# EAGLE design T07 411 (EAGLE 7.1.0)
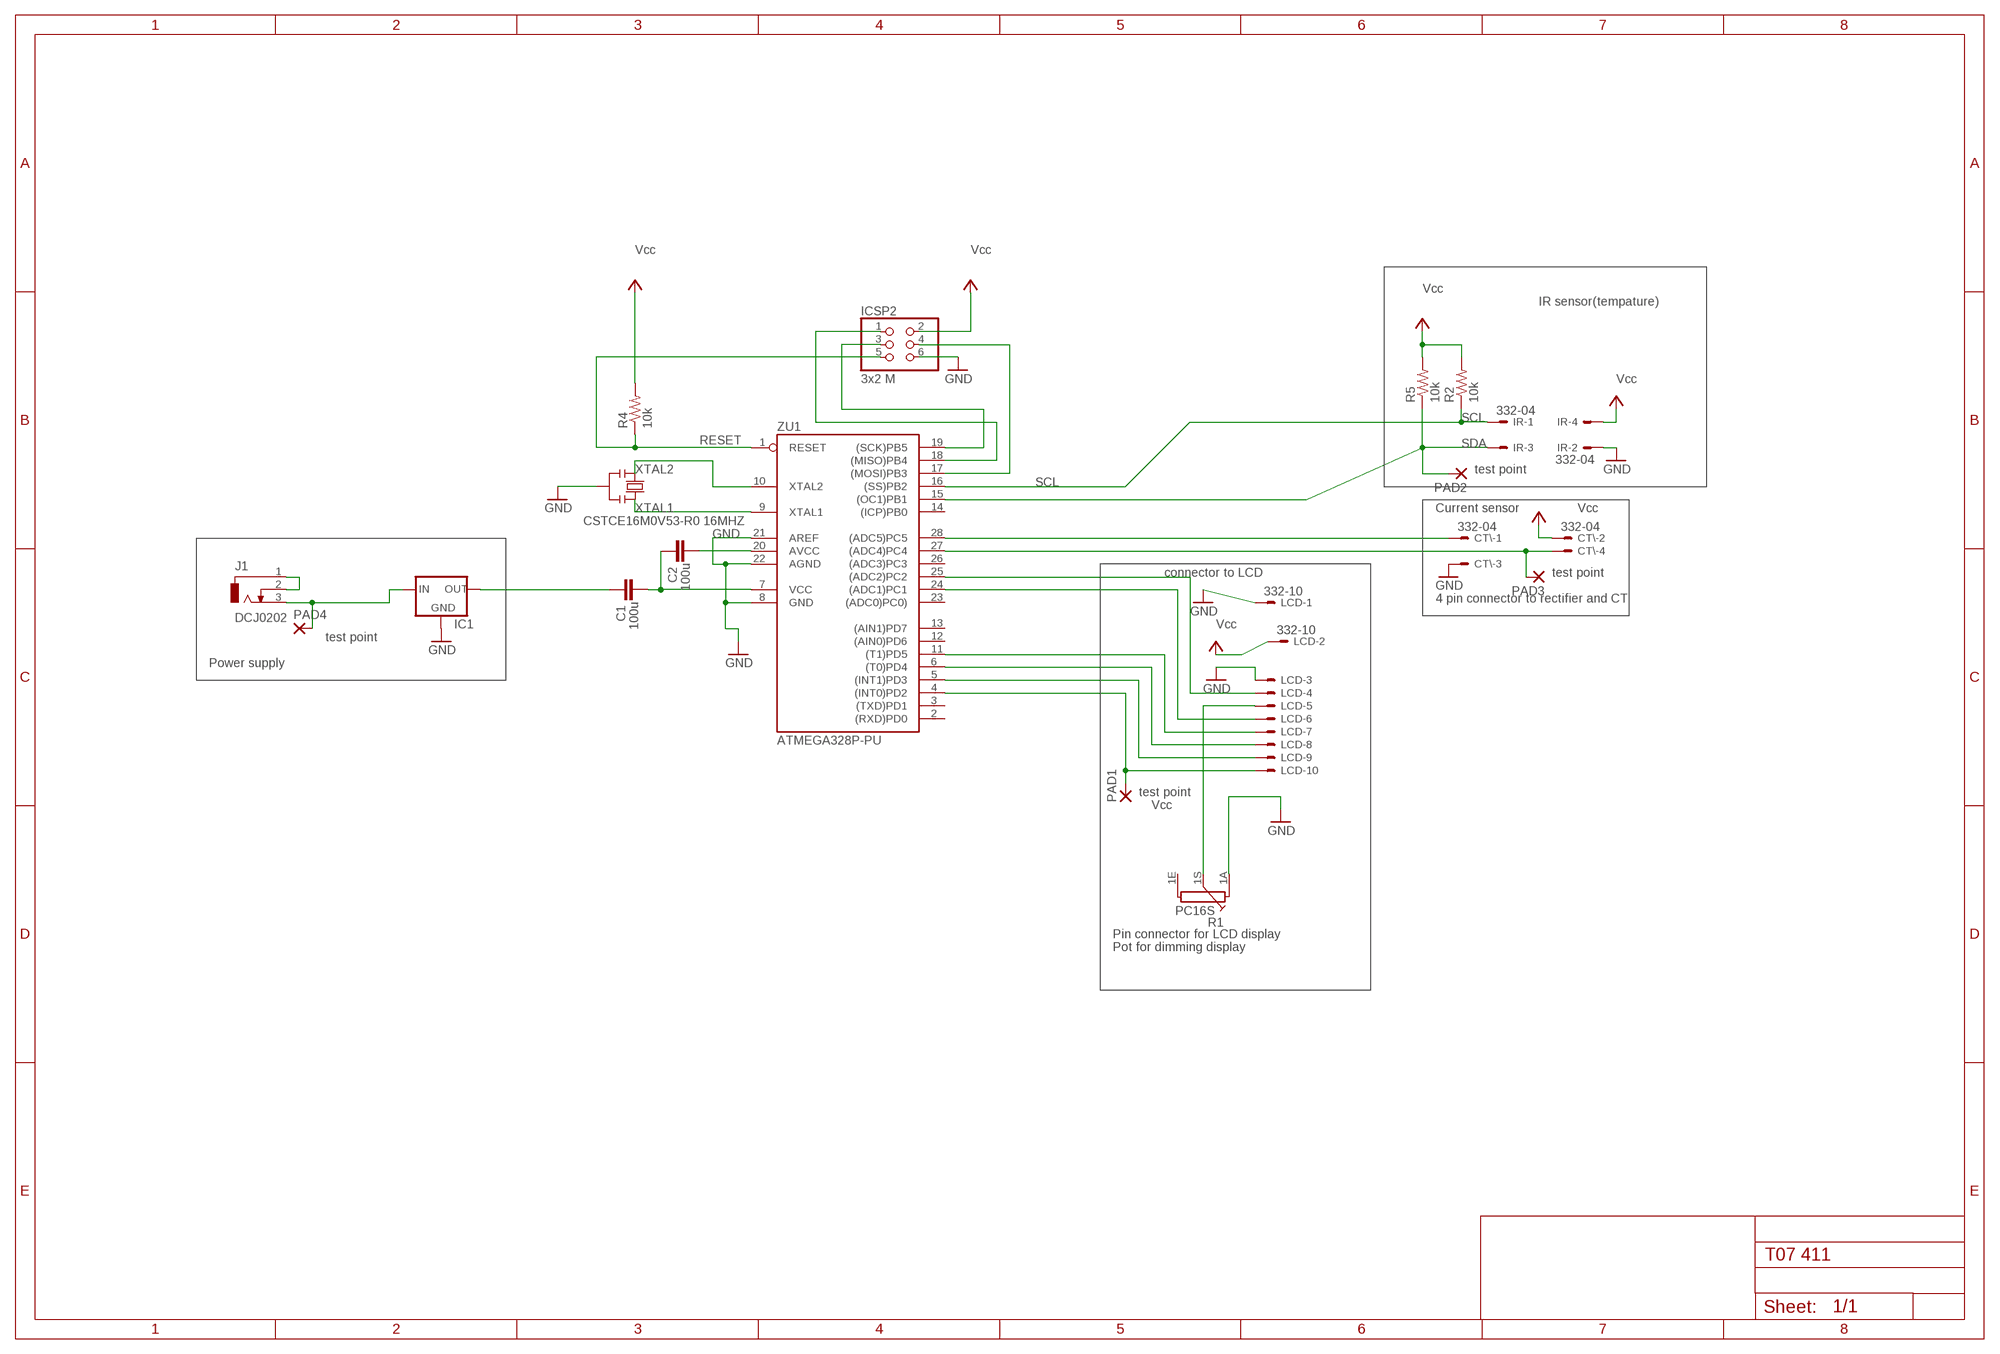
[diagram p0: schematic, sheet 1]

## Parts
C1  100u  C-EU0603-RND  [C0603-ROUND]
C2  100u  C-EU0603-RND  [C0603-ROUND]
CT\  332-04  [332-04]
IC1  78XXL  [78XXL]
ICSP2  3x2 M  PINHD-2X3  [2X03]
IR  332-04  [332-04]
J1  DCJ0202  [DCJ0202]
LCD  332-10  [332-10]
PAD1  1,6/0,9  [1,6/0,9]
PAD2  1,6/0,9  [1,6/0,9]
PAD3  1,6/0,9  [1,6/0,9]
PAD4  1,6/0,9  [1,6/0,9]
R1  PC16S  [PC16S]
R2  10k  RESISTOR0402-RES  [0402-RES]
R4  10k  RESISTOR0402-RES  [0402-RES]
R5  10k  RESISTOR0402-RES  [0402-RES]
Y3  CSTCE16M0V53-R0 16MHZ  RESONATORMU  [RESONATOR]
ZU1  ATMEGA328P-PU  [DIL28-3]

## Nets
+5V [usbvcc]: CT\.2 ICSP2.2 IR.4 LCD.2 R2.2 R4.2 R5.2
GND [gnd]: CT\.3 IC1.GND ICSP2.6 IR.2 LCD.1 LCD.3 R1.1A Y3.2 ZU1.8(GND) ZU1.21(AREF) ZU1.22(AGND)
MISO1: ICSP2.1 ZU1.18((MISO)PB4)
MOSI1: ICSP2.4 ZU1.17((MOSI)PB3)
N$1: LCD.10 PAD1.1(P) ZU1.4((INT0)PD2)
N$2: LCD.9 ZU1.5((INT1)PD3)
N$3: LCD.8 ZU1.6((T0)PD4)
N$4: LCD.7 ZU1.11((T1)PD5)
N$5: LCD.6 ZU1.24((ADC1)PC1)
N$6: LCD.4 ZU1.25((ADC2)PC2)
N$7: LCD.5 R1.1S
N$8 [usbvcc]: C1.2 IC1.OUT
N$9 [usbvcc]: IC1.IN J1.3 PAD4.1(P)
N$10 [usbvcc]: C1.1 C2.2 ZU1.7(VCC)
N$11 [usbvcc]: C2.1 ZU1.20(AVCC)
N$12: CT\.1 ZU1.28((ADC5)PC5)
N$13: CT\.4 PAD3.1(P) ZU1.27((ADC4)PC4)
N$14 [gnd]: J1.1 J1.2
RESET: ICSP2.5 R4.1 ZU1.1(RESET)
SCK1: ICSP2.3 ZU1.19((SCK)PB5)
SCL: IR.1 R2.1 ZU1.16((SS)PB2)
SDA: IR.3 PAD2.1(P) R5.1 ZU1.15((OC1)PB1)
XTAL1: Y3.3 ZU1.9(XTAL1)
XTAL2: Y3.1 ZU1.10(XTAL2)
Unconnected: R1.1E ZU1.2((RXD)PD0) ZU1.3((TXD)PD1) ZU1.12((AIN0)PD6) ZU1.13((AIN1)PD7) ZU1.14((ICP)PB0) ZU1.23((ADC0)PC0)) ZU1.26((ADC3)PC3)

## Notes on the sheet
- Vcc | Vcc
- Vcc
- IR sensor(tempature)
- Vcc
- test point
- Current sensor | Vcc
- connector to LCD | test point
- 4 pin connector to rectifier and CT
- Vcc
- test point
- Power supply
- test point
- Vcc
- Pin connector for LCD display
- Pot for dimming display

## Library data of the parts
C1 C2 = SmartPrj:C-EU: CAPACITOR, European symbol
CT\ IR = con-garry:332-04: 4 Pin - 2mm Dual Row Source: www.mpe-connector.de / garry_shortform_2012.pdf
IC1 = v-reg:78XXL: VOLTAGE REGULATOR
ICSP2 = SmartPrj:PINHD-2X3: PIN HEADER
J1 = con-jack:DCJ0202: DC POWER JACK Source: DCJ0202.pdf; OC_FARNELL: unknown; OC_NEWARK: unknown
LCD = con-garry:332-10: 10 Pin - 2mm Dual Row Source: www.mpe-connector.de / garry_shortform_2012.pdf
PAD1-PAD4 = wirepad:1,6/0,9: THROUGH-HOLE PAD
R1 = piher:PC16S: POTENTIOMETER single carbon potentiometer, 16 mm, S3ROH; OC_FARNELL: 4452940; OC_NEWARK: unknown
R2 R4 R5 = SparkFun:RESISTOR: Resistor Basic schematic elements and footprints for 0603, 1206, and PTH 1/10th watt (small) resistors.
Y3 = SmartPrj:RESONATOR
ZU1 = SmartPrj:ATMEGA328P-: MICROCONTROLLER 4 Kbytes FLASH 128 bytes SRAM 256 bytes EEPROM UART 6-channel 10 bit ADC

## Net classes
1 power: width 0.61 mm, drill 0.61 mm, clearance 0.254 mm
2 gnd: width 0.305 mm, drill 0.559 mm, clearance 0.254 mm
3 usbvcc: width 0.508 mm, drill 0.61 mm, clearance 0.254 mm
4 aref: width 0.406 mm, drill 0.61 mm, clearance 0.254 mm

## Board
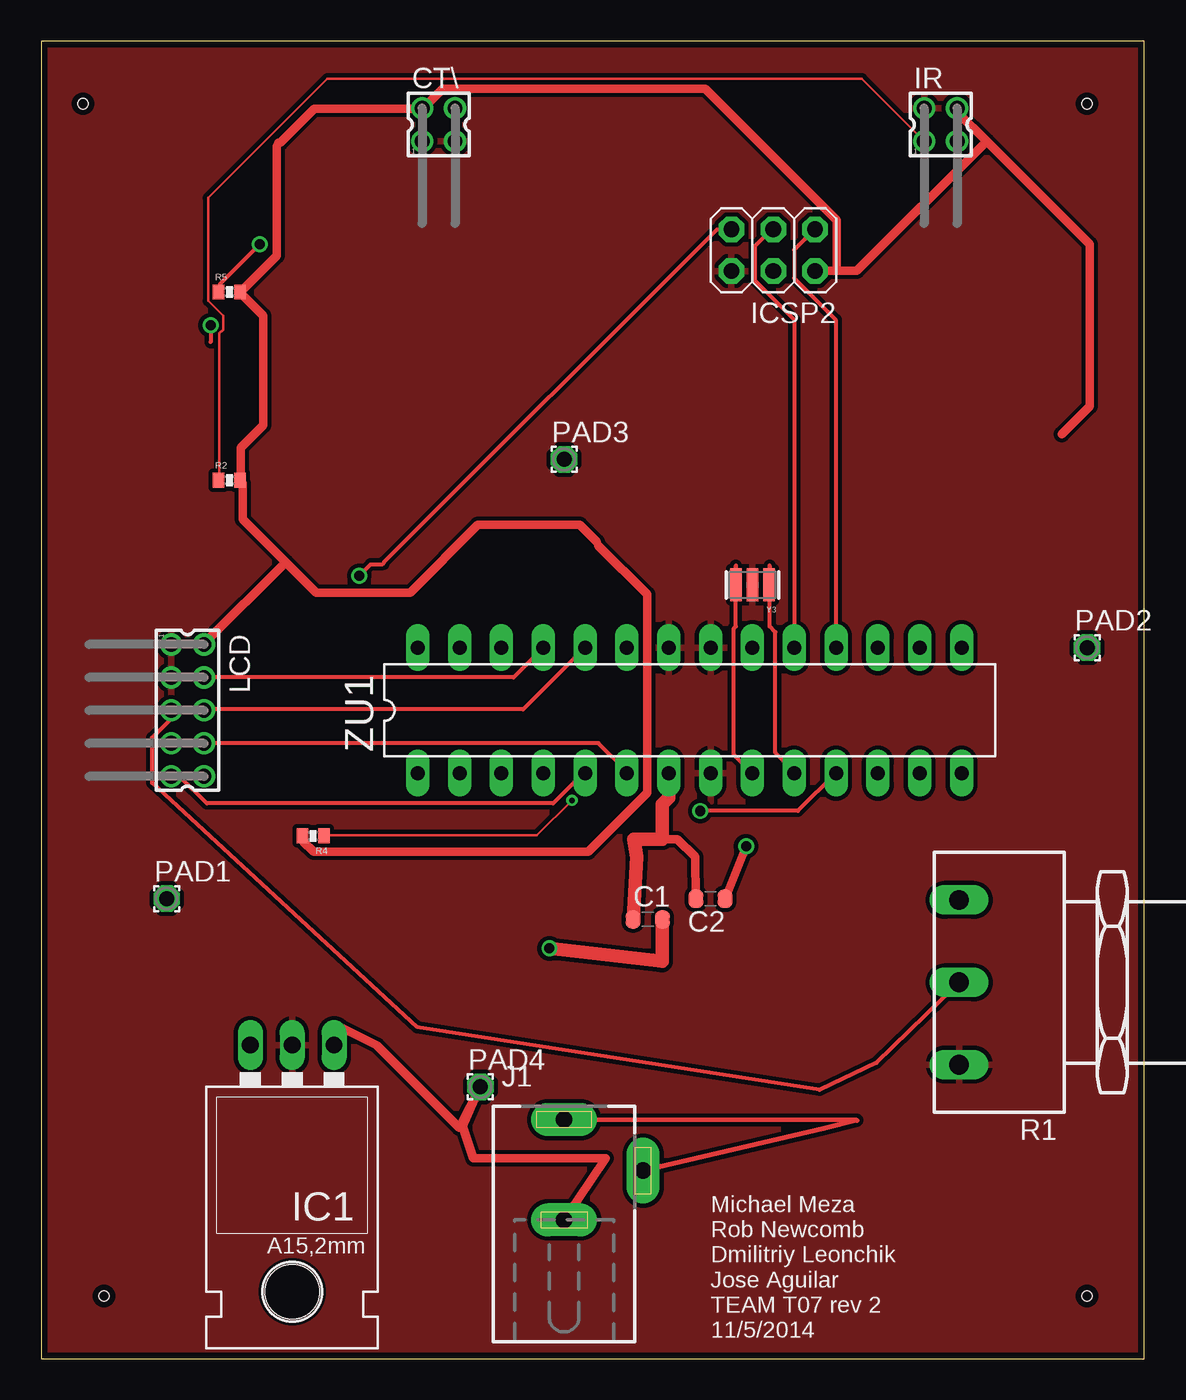
[diagram p1: board, top side]
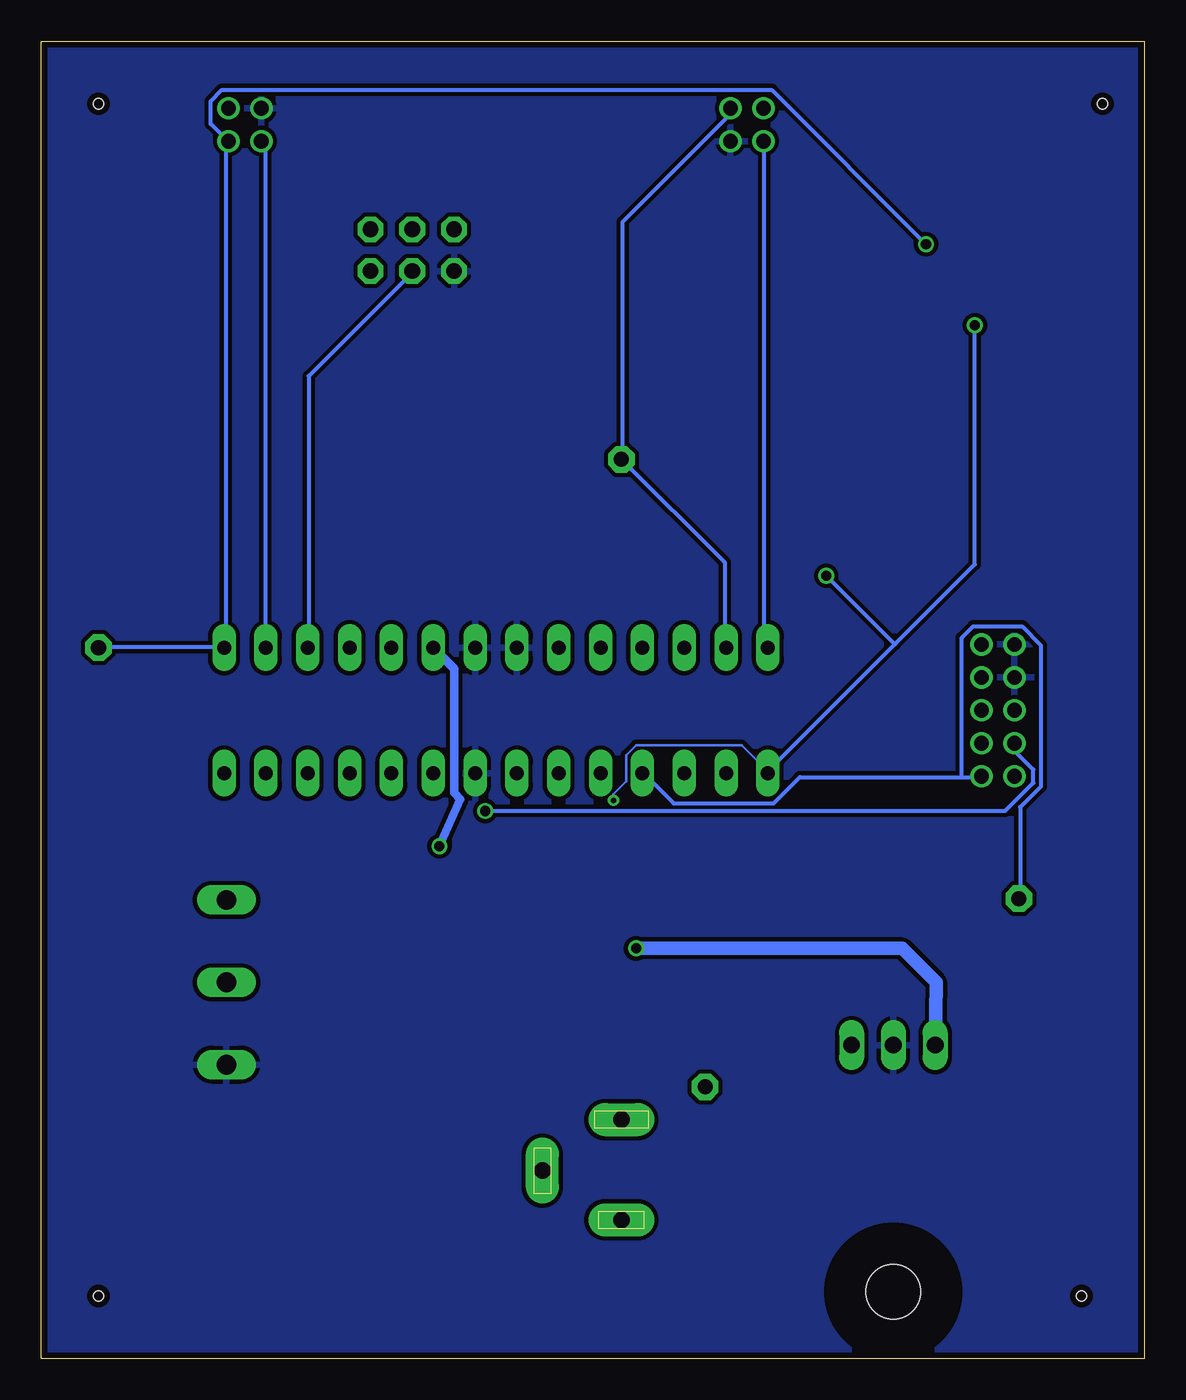
[diagram p2: board, bottom side, seen from below]

Size 66.98 x 80 mm. Coordinates in mm from the lower left corner, seen from the top.
Outline: 0,0 66.98,0 66.98,80 0,80 0,0
Copper layers (1*16): Top 0.0356mm / dielectric 1.5011mm / Bottom 0.0356mm
Design rules "OSH-Park-2-layer": minimum track width 6mil, minimum drill 13mil, track to track 6mil, track to pad 6mil, pad to pad 6mil, via to via 6mil, smd to smd 6mil, copper to edge 15mil, drill to drill 6mil, minimum pad ring 7mil, minimum via ring 7mil, stop-mask expansion 3mil, vias tented up to drill 0mil, thermal gap 10mil
Holes 0.6 mm at 3.81,3.81 63.5,3.81 63.5,76.2 2.54,76.2

### Footprints (pad centres in the part's own frame; a part is rotated, then mirrored left to right if it is on the bottom)
C0603-ROUND = smd 0.898 x 1.1: 1 -0.889,0; 2 0.889,0
332-04 = drill 0.9 pad 1.27: 1 -1,-1; 2 -1,1; 3 1,-1; 4 1,1
78XXL = drill 1.016 long: GND 0,-3.81; IN -2.54,-3.81; OUT 2.54,-3.81 | hole 3.302: 0,11.176
2X03 = drill 0.95 pad 1.55 octagon: 1 -2.54,-1.27; 2 -2.54,1.27; 3 0,-1.27; 4 0,1.27; 5 2.54,-1.27; 6 2.54,1.27
DCJ0202 = drill 1 pad 2 long: 1 0,3.1; 2 4.8,0; 3 0,-3
332-10 = drill 0.9 pad 1.27: 1 -4,-1; 2 -4,1; 3 -2,-1; 4 -2,1; 5 0,-1; 6 0,1; 7 2,-1; 8 2,1; 9 4,-1; 10 4,1
1,6/0,9 = drill 0.914 pad 1.6 octagon: 1 0,0
PC16S = drill 1.2 long: 1A -5,6.5; 1E 5,6.5; 1S 0,6.5
0402-RES = smd 0.7 x 0.9: 1 -0.65,0; 2 0.65,0
RESONATOR = smd 0.7 x 2: 1 -1,0; 2 0,0; 3 1,0
DIL28-3 = drill 0.85 pad 1.422 long: 1 -16.51,-3.81; 2 -13.97,-3.81; 3 -11.43,-3.81; 4 -8.89,-3.81; 5 -6.35,-3.81; 6 -3.81,-3.81; 7 -1.27,-3.81; 8 1.27,-3.81; 9 3.81,-3.81; 10 6.35,-3.81; 11 8.89,-3.81; 12 11.43,-3.81; 13 13.97,-3.81; 14 16.51,-3.81; 15 16.51,3.81; 16 13.97,3.81; 17 11.43,3.81; 18 8.89,3.81; 19 6.35,3.81; 20 3.81,3.81; 21 1.27,3.81; 22 -1.27,3.81; 23 -3.81,3.81; 24 -6.35,3.81; 25 -8.89,3.81; 26 -11.43,3.81; 27 -13.97,3.81; 28 -16.51,3.81

### Placement (x,y rotation side)
C1  36.83,26.67 0 top
C2  40.64,27.94 180 top
CT\  24.13,74.93 0 top
IC1  15.24,15.24 180 top
ICSP2  44.45,67.31 180 top
IR  54.61,74.93 0 top
J1  31.75,11.43 0 top
LCD  8.89,39.37 270 top
PAD1  7.62,27.94 0 top
PAD2  63.5,43.18 0 top
PAD3  31.75,54.61 0 top
PAD4  26.67,16.51 0 top
R1  62.23,22.86 90 top
R2  11.43,53.34 0 top
R4  16.51,31.75 180 top
R5  11.43,64.77 0 top
Y3  43.18,46.99 180 top
ZU1  39.37,39.37 0 top

### Tracks (layer width: path | path; a pad name or v marks a point on that pad's centre or on a via)
+5V
  Top 0.508: 14.84,48.37 16.69,46.52 22.4,46.52 26.52,50.63 32.69,50.63 33.72,49.61 33.83,49.38 36.8,46.41 36.8,34.37 33.22,30.79 16.54,30.79 15.93,31.39 15.93,31.7 R4.2 | 14.84,48.37 12.23,50.98 12.23,53.15 R2.2 12.12,53.38 12.12,55.32 13.49,56.69 13.49,63.32 12.12,64.69 R5.2 12.23,64.92 14.29,66.98 14.29,73.61 14.4,73.84 14.52,73.84 16.57,75.89 23.09,75.89 CT\.2 23.32,76.05 24.38,77.11 40.31,77.11 48.31,69.11 48.31,66.06 | 57.4,73.93 63.66,67.67 63.66,57.84 61.95,56.12 | 57.4,73.93 55.66,75.67 55.66,75.89 IR.4 | 48.31,66.06 49.53,66.06 57.4,73.93 | 48.31,66.06 47.02,66.06 ICSP2.2 | 14.84,48.37 9.91,43.43 LCD.2
GND
  pour Bottom: -2.54,81.28 -2.54,-2.54 68.58,-2.54 68.58,81.28
  pour Top: -2.54,81.28 -2.54,-2.54 68.58,-2.54 68.58,81.28
MISO1
  Top 0.254: ZU1.18 48.23,43.2 48.23,63.09 45.72,65.61 45.72,67.32 46.98,68.58 ICSP2.1
MOSI1
  Bottom 0.254: ZU1.17 50.75,43.2 50.75,59.66 44.46,65.95 ICSP2.4
N$1
  Bottom 0.254: 11.09,35.32 20.92,35.32 22.52,33.72 28.57,33.72 30.4,35.55 ZU1.4 | 11.09,35.32 9.94,35.32 LCD.10 | 11.09,35.32 11.09,43.78 10.4,44.46 7.43,44.46 6.29,43.32 6.29,34.75 7.54,33.49 7.54,28 PAD1.1
N$2
  Top 0.254: LCD.9 8,35.32 8.46,35.32 10.06,33.72 31.09,33.72 32.92,35.55 ZU1.5
N$3
  Top 0.254: LCD.8 9.94,37.38 33.83,37.38 35.55,35.66 ZU1.6
N$4  (via drill 0.61)
  Top 0.254: v40.02,33.26 45.95,33.26 48.23,35.55 ZU1.11
  Bottom 0.254: v40.02,33.26 8.46,33.26 6.74,34.98 6.74,35.78 7.89,36.92 7.89,37.26 LCD.7
N$5
  Top 0.254: LCD.6 9.94,39.43 29.26,39.43 32.92,43.09 ZU1.24
N$6
  Top 0.254: LCD.4 9.94,41.38 28.69,41.38 30.4,43.09 ZU1.25
N$7
  Top 0.254: LCD.5 7.89,39.32 7.89,38.86 6.74,37.72 6.74,34.98 22.85,20.14 47.27,16.33 50.71,17.97 R1.1S
N$8  (via drill 0.61)
  Top 0.813: v30.86,24.92 37.69,24.13 C1.2
  Bottom 0.813: v30.86,24.92 14.71,24.92 12.65,22.86 IC1.OUT
N$9
  Top 0.508: IC1.IN 17.83,20.32 20.37,19.02 25.38,14.02 PAD4.1 25.6,14.1 26.24,12.19 34.29,12.19 J1.3
N$10
  Top 0.508: 37.72,31.55 38.63,31.55 39.7,30.48 C2.2
  Top 0.813: C1.1 36.17,30.48 35.97,31.55 37.72,31.55 37.72,33.68 38.1,34.06 ZU1.7
N$11  (via drill 0.61)
  Top 0.508: v42.8,31.11 C2.1
  Bottom 0.508: v42.8,31.11 41.53,33.98 41.91,34.37 41.91,41.91 ZU1.20
N$12
  Bottom 0.254: CT\.1 23.09,73.84 23.09,43.43 22.86,43.2 ZU1.28
N$13
  Bottom 0.254: CT\.4 25.15,75.89 25.15,75.55 31.66,69.04 31.66,54.63 PAD3.1 25.49,48.35 25.49,43.2 ZU1.27
N$14
  Top 0.305: J1.2 47.5,13.97 49.53,14.48 J1.1
RESET  (via drill 0.33, 0.61)
  Top 0.152: v32.23,33.91 30.1,31.77 17.22,31.77 R4.1 | 20.69,48.23 20.8,48.23 20.8,48.35
  Top 0.254: v10.29,62.75 10.29,61.72 | 20.69,48.23 20,48.23 v19.32,47.55 | ICSP2.5 41.03,68.58 20.8,48.35
  Bottom 0.152: v32.23,33.91 32.23,34.29 31.47,35.05 31.47,36.65 30.86,37.26 24.46,37.26 22.94,35.74 ZU1.1
  Bottom 0.254: v10.29,62.75 10.29,48.23 15.14,43.38 | 15.14,43.38 22.86,35.66 ZU1.1 | 15.14,43.38 v19.32,47.55
SCK1
  Top 0.254: ZU1.19 45.72,63.09 43.32,65.49 43.32,67.55 44.35,68.58 ICSP2.3
SCL
  Top 0.152: R2.1 10.82,53.34 10.82,62.26 11.05,62.48 11.05,63.32 10.13,64.24 10.13,70.48 17.37,77.72 49.84,77.72 53.57,73.99 IR.1
  Bottom 0.152: 53.61,73.84 53.65,73.91 IR.1
  Bottom 0.254: 53.61,73.84 53.38,73.61 53.38,43.2 ZU1.16
SDA  (via drill 0.61)
  Top 0.254: v13.26,67.67 10.86,65.27 10.86,64.81 R5.1
  Bottom 0.254: v13.26,67.67 22.63,77.04 56.01,77.04 56.69,76.35 56.69,74.98 55.66,73.95 IR.3 55.78,73.95 55.78,43.2 ZU1.15 56.01,43.2 63.44,43.2 PAD2.1
XTAL1
  Top 0.254: Y3.3 42.18,48.16 42.18,44.46 42.06,44.35 42.06,36.69 43.09,35.66 ZU1.9
XTAL2
  Top 0.254: Y3.1 44.23,48.16 44.23,44.46 44.58,44.12 44.58,36.8 45.72,35.66 ZU1.10

### Text on the board
tNames: Michael Meza / Rob Newcomb / Dmilitriy Leonchik / Jose Aguilar / TEAM T07 rev 2 / 11/5/2014